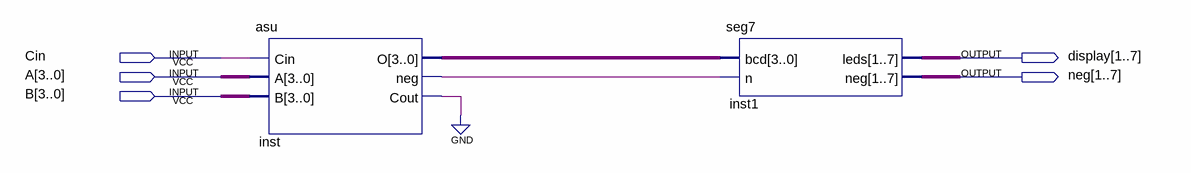
[diagram p0: schematic sheet]
// Quartus schematic CombinedASU1.bdf as structural Verilog: 2 symbols, 5 pins
module CombinedASU1 (
  input  Cin,
  input  [3:0] A,
  input  [3:0] B,
  output [1:7] display,
  output [1:7] neg
);

  wire inst_cout, inst_neg;
  wire [3:0] inst_o;

  asu inst (.Cin(Cin), .A(A), .B(B), .O(inst_o), .neg(inst_neg), .Cout(inst_cout));
  seg7 inst1 (.bcd(inst_o), .n(inst_neg), .leds(display), .neg(neg));
  // also tied to GND on the sheet: inst_cout
endmodule
